# EAGLE design riffleito-REVC (EAGLE 6.5.0)
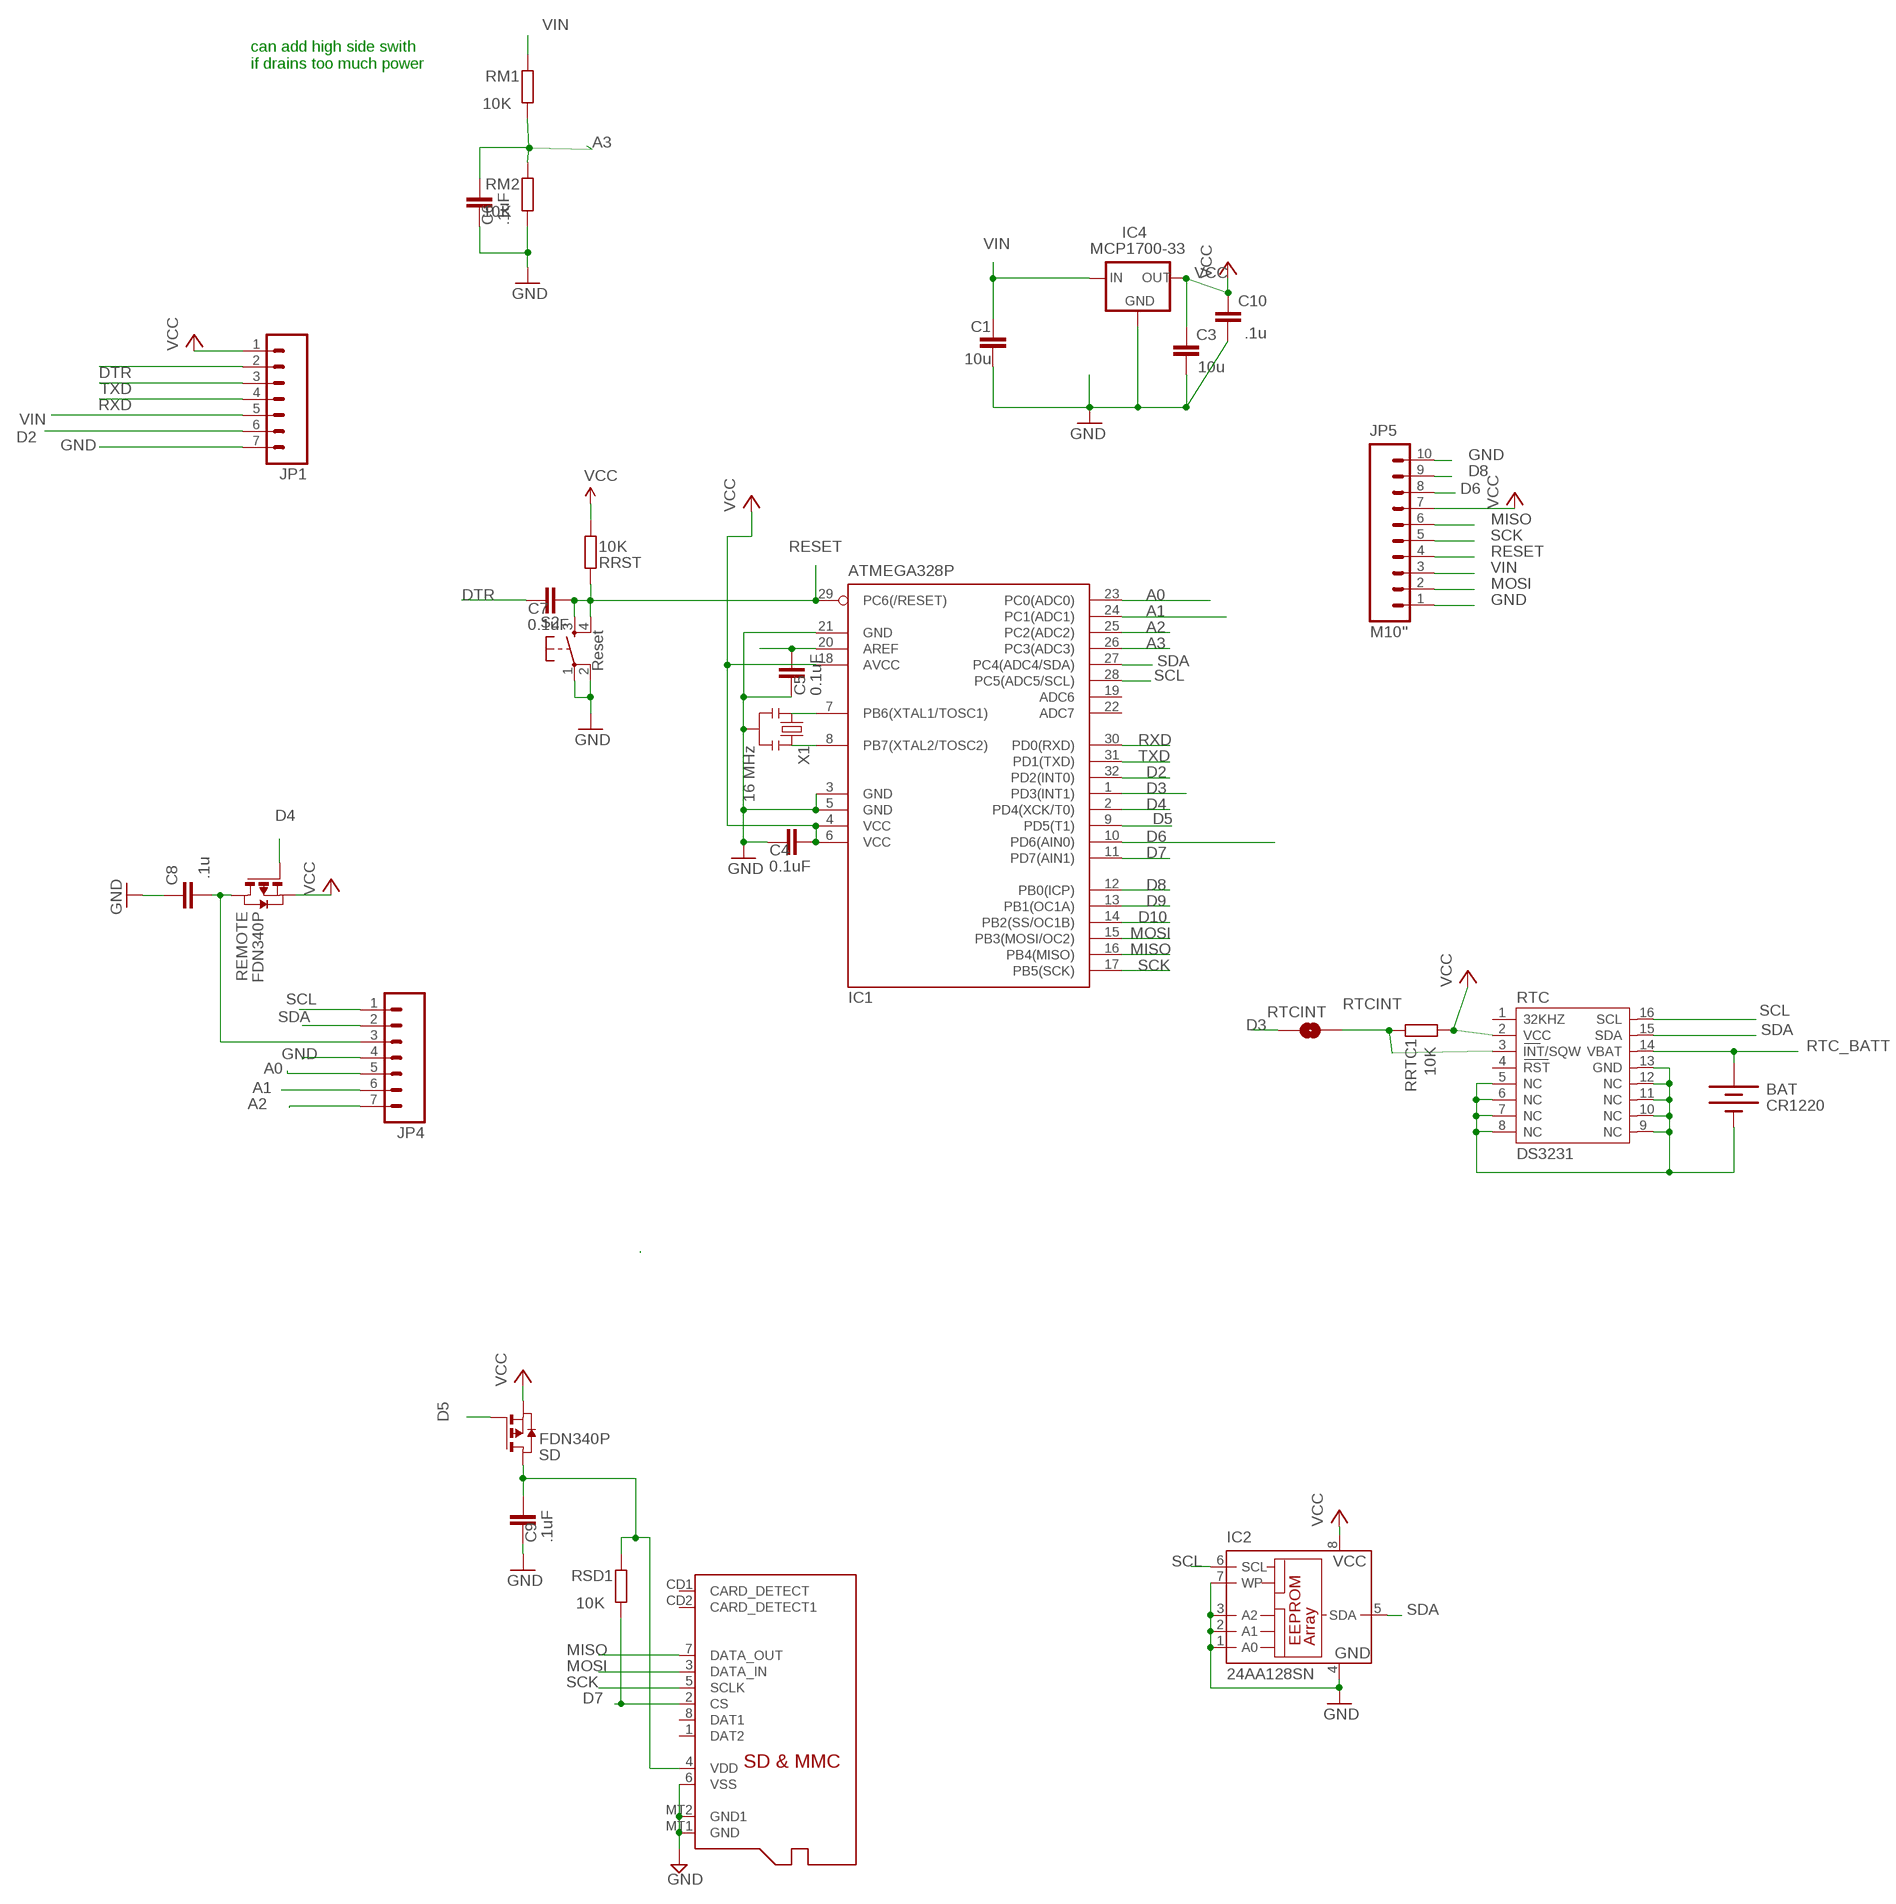
[diagram p0: schematic, sheet 1]

## Parts
BAT  CR1220  BATTERYBATTERY_12MM_SMT  [BATTCON_12MM_SMT]
C1  10u  C-EUC0805  [C0805]
C3  10u  C-EUC0805  [C0805]
C4  0.1uF  C-EUC0805  [C0805@1]
C5  0.1uF  C-EUC0805  [C0805@1]
C6  .1uF  C-EUC0805  [C0805@1]
C7  0.1uF  C-EUC0805  [C0805@1]
C8  .1u  C-EUC0805  [C0805]
C9  .1uF  C-EUC0805  [C0805@1]
C10  .1u  C-EUC0805  [C0805]
IC1  ATMEGA328P  MEGA8-AI  [TQFP32-08]
IC2  24AA128SN  [SO-08]
IC4  MCP1700-33  MCP1700SOT233  [SOT23]
JP1  M07  [1X07]
JP4  M07  [1X07]
JP5  M10"  [1X10]
MICROSD  MICROSD  [MICROSD]
REMOTE  FDN340P  PMOSSOT23  [SOT-23]
RM1  10K  R-EU_R0805  [R0805]
RM2  10K  R-EU_R0805  [R0805]
RRST  10K  R-EU_R0805  [R0805]
RRTC1  10K  R-EU_R0805  [R0805]
RSD1  10K  R-EU_R0805  [R0805]
RTC  DS3231  [DS3231]
RTCINT  SOLDERJUMPERNO  [SJ_2S-NO]
S2  Reset  TAC_SWITCHSMD  [TACTILE_SWITCH_SMD]
SD  FDN340P  PMOSSOT23  [SOT-23]
X1  16 MHz  RESONATORSMD  [RESONATOR-SMD]

## Nets
A0: IC1.23(PC0(ADC0)) JP4.5
A1: IC1.24(PC1(ADC1)) JP4.6
A2: IC1.25(PC2(ADC2)) JP4.7
A3: C6.2 IC1.26(PC3(ADC3)) RM1.1 RM2.2
AREF: C5.2 IC1.20(AREF)
D2: IC1.32(PD2(INT0)) JP1.6
D3: IC1.1(PD3(INT1)) RTCINT.2
D4: IC1.2(PD4(XCK/T0)) REMOTE.3(G)
D5: IC1.9(PD5(T1)) SD.3(G)
D6: IC1.10(PD6(AIN0)) JP5.8
D7: IC1.11(PD7(AIN1)) MICROSD.2(CS) RSD1.1
D8: IC1.12(PB0(ICP)) JP5.9
D9: IC1.13(PB1(OC1A))
D10: IC1.14(PB2(SS/OC1B))
DTR: C7.1 JP1.2
GND: BAT.P$1(-) C1.2 C3.2 C4.1 C5.1 C6.1 C8.1 C9.1 C10.2 IC1.3(GND) IC1.5(GND) IC1.21(GND) IC2.1(A0) IC2.2(A1) IC2.3(A2) IC2.4(GND) IC2.7(WP) IC4.1(GND) JP1.7 JP4.4 JP5.1 JP5.10 MICROSD.6(VSS) MICROSD.MT1(GND) MICROSD.MT2(GND1) RM2.1 RTC.5(NC) RTC.6(NC) RTC.7(NC) RTC.8(NC) RTC.9(NC) RTC.10(NC) RTC.11(NC) RTC.12(NC) RTC.13(GND) S2.1 S2.2 X1.2
MISO: IC1.16(PB4(MISO)) JP5.6 MICROSD.7(DATA_OUT)
MOSI: IC1.15(PB3(MOSI/OC2)) JP5.2 MICROSD.3(DATA_IN)
N$2: IC1.8(PB7(XTAL2/TOSC2)) X1.3
N$3: IC1.7(PB6(XTAL1/TOSC1)) X1.1
RESET: C7.2 IC1.29(PC6(/RESET)) JP5.4 RRST.2 S2.3 S2.4
RTC_BATT: BAT.P$2(+) RTC.14(VBAT)
RTCINT: RRTC1.2 RTC.3(INT/SQW) RTCINT.1
RXD: IC1.30(PD0(RXD)) JP1.4
SCK: IC1.17(PB5(SCK)) JP5.5 MICROSD.5(SCLK)
SCL: IC1.28(PC5(ADC5/SCL)) IC2.6(SCL) JP4.1 RTC.16(SCL)
SDA: IC1.27(PC4(ADC4/SDA)) IC2.5(SDA) JP4.2 RTC.15(SDA)
TXD: IC1.31(PD1(TXD)) JP1.3
VCC: C3.1 C4.2 C8.2 C10.1 IC1.4(VCC) IC1.6(VCC) IC1.18(AVCC) IC2.8(VCC) IC4.2(OUT) JP1.1 JP4.3 JP5.7 REMOTE.1(D) REMOTE.2(S) RRST.1 RRTC1.1 RTC.2(VCC) SD.2(S)
VDD: C9.2 MICROSD.4(VDD) RSD1.2 SD.1(D)
VIN [power]: C1.1 IC4.3(IN) JP1.5 JP5.3 RM1.2
Unconnected: IC1.19(ADC6) IC1.22(ADC7) MICROSD.1(DAT2) MICROSD.8(DAT1) MICROSD.CD1(CARD_DETECT) MICROSD.CD2(CARD_DETECT1) RTC.1(32KHZ) RTC.4(RST)

## Notes on the sheet
- can add high side swith
  if drains too much power

## Library data of the parts
BAT = SparkFunNew:BATTERY: Battery Holders Various common sizes : AA, AAA, 20mm coin cell and 12mm coin cell.
C1 C3 C8 C10 = resistor:C-EU: CAPACITOR, European symbol
C4-C7 C9 = rcl:C-EU: CAPACITOR, European symbol
IC1 = atmel:MEGA8: MICROCONTROLLER 8 Kbytes FLASH, 1 kbytes SRAM, 512 bytes EEPROM, USART, 6-channel 10 bit ADC, 2-channel 8 bit ADC Pin compatible with Atmega48, ATMega88, ATMega168 Source: avr.lbr; MPN: ATMEGA8-16AU; OC_FARNELL: 9171371; OC_NEWARK: 73M8863
IC2 = microchip:24*: Serial EEPROM I2C; MF: MICROCHIP; MPN: 24AA128-I/SN; OC_FARNELL: unknown; OC_NEWARK: 92C6842
IC4 = adafruit:MCP1700: VOLTAGE REGULATOR
JP1 JP4 = SparkFun-Connectors:M07: Header 7 Standard 7-pin 0.1" header. Use with straight break away headers (SKU : PRT-00116), right angle break away headers (PRT-00553), swiss pins (PRT-00743), machine pins (PRT-00117), and female headers (PRT-00115). NOTES ON THE VARIANTS LOCK and LOCK_LONGPADS... This footprint was designed to help hold the alignment of a through-hole component (i.e. 7-pin header) while soldering it into place. You may notice that each hole has been shifted either up or down by 0.005 of an inch from it's more standard position (which is usually a perfectly straight line). This slight alteration caused the pins (the squares in the middle) to touch the edges of the holes. Because they are alternating, it causes a "brace" to hold the header in place. 0.005 has proven to be the perfect amount of "off-center" position when using our standard breakaway headers. Although looks a little odd when you look at the bare footprint, once you have a header in there, the alteration is very hard to notice. Also, if you push a header all the way into place, it is covered up entirely on the bottom side. This idea of altering the position of holes to aid alignment will be further integrated into the Sparkfun Library for other footprints. It can help hold any component with 3 or more connection pins.
JP5 = SparkFun-Connectors:M10: Header 10 Standard 10-pin 0.1" header. Use with straight break away headers (SKU : PRT-00116), right angle break away headers (PRT-00553), swiss pins (PRT-00743), machine pins (PRT-00117), and female headers (PRT-00115).
MICROSD = adafruit:MICROSD: Micro-SD / Transflash card holder with SPI pinout For the 3M # 2908-05WB-MG and/or 4UCON #19656 push-push type
REMOTE SD = zetex:PMOSSOT23: MOS FET
RM1 RM2 RRST RRTC1 RSD1 = rcl:R-EU_: RESISTOR, European symbol
RTC = _lh-library:DS3231
RTCINT = _SparkFun:SOLDERJUMPER: Solder Jumper Standard SMD solder jumper. Used to automate production. Two varients : Normally Open and Normally Closed are the same, but have different paste layers. NC will have a large amount of paste and should jumper during reflow.
S2 = SparkFun:TAC_SWITCH: Momentary Switch Button commonly used for reset or general input. Spark Fun Electronics SKU : COM-00097
X1 = SparkFun:RESONATOR: Resonator Small SMD resonator. This is the itty bitty 10/20MHz resonators with built in caps. CSTCE10M0G55 and CSTCE20M0V53. Footprint has been reviewed closely but hasn't been tested yet.

## Net classes
0 default: width 0.203 mm, drill 0.33 mm, clearance 0.203 mm
1 power: width 0.381 mm, drill 0.33 mm, clearance 0.254 mm

## Board
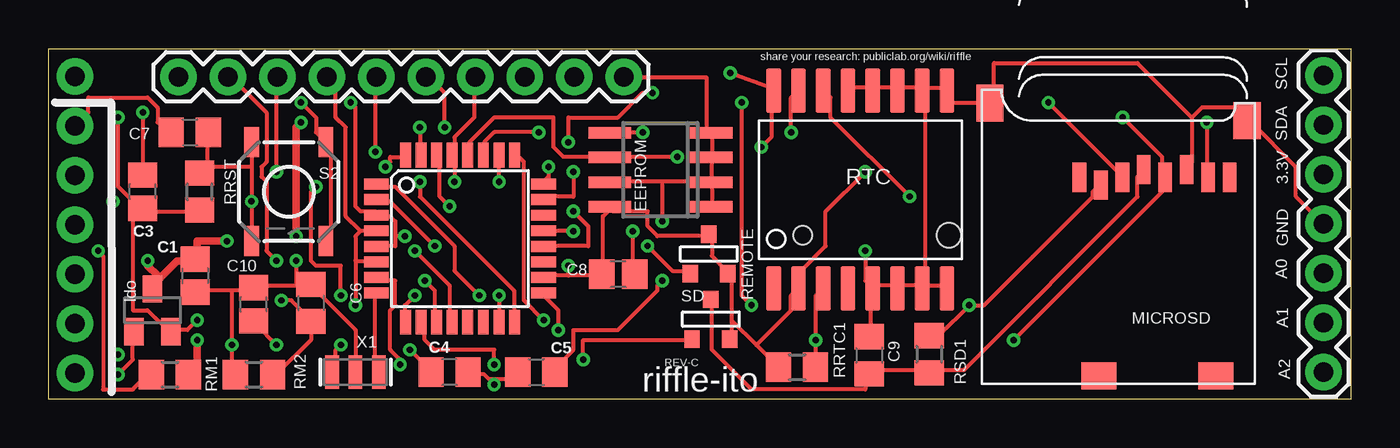
[diagram p1: board, top side]
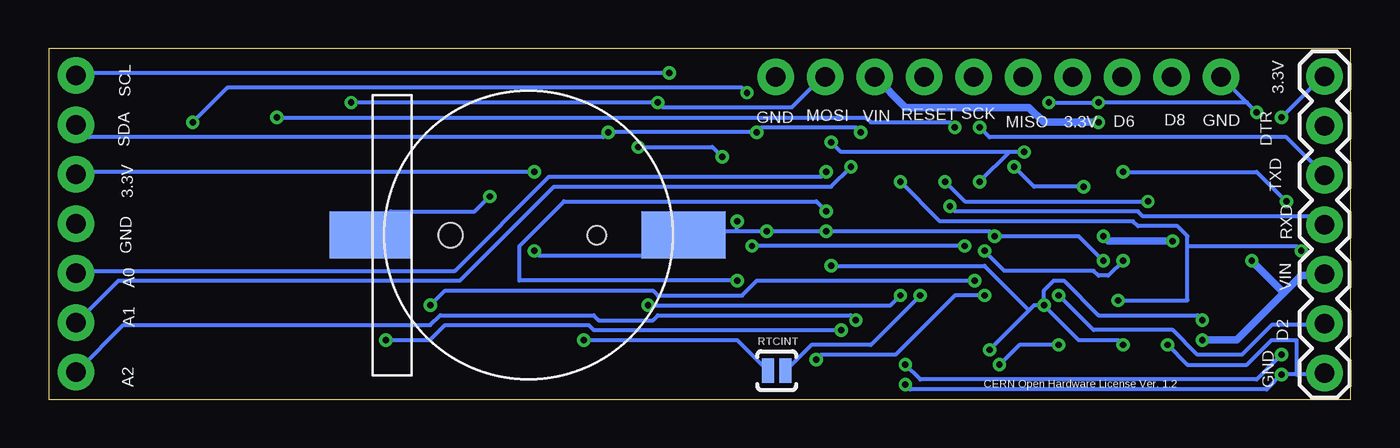
[diagram p2: board, bottom side, seen from below]

Size 66.83 x 18.01 mm. Coordinates in mm from the lower left corner, seen from the top.
Outline: 0,0 0,18.01 66.83,18.01 66.83,0 0,0
Copper layers (1*16): Top 0.0356mm / dielectric 1.5011mm / Bottom 0.0356mm
Design rules "LaenPCBOrder": minimum track width 6mil, minimum drill 13mil, track to track 6mil, track to pad 6mil, pad to pad 6mil, via to via 6mil, smd to smd 6mil, copper to edge 15mil, drill to drill 6mil, minimum pad ring 7mil, minimum via ring 7mil, stop-mask expansion 3mil, vias tented up to drill 0mil, thermal gap 10mil

### Footprints (pad centres in the part's own frame; a part is rotated, then mirrored left to right if it is on the bottom)
BATTCON_12MM_SMT = smd 2.4 x 4.3: P$1 0,11.96 | smd 2.4 x 4.2: P$2 0,-4.1 | hole 0.95: 0,7.5 | hole 1.25: 0,0
C0805 = smd 1.3 x 1.5: 1 -0.85,0; 2 0.85,0
C0805@1 = smd 1.3 x 1.5: 1 -0.95,0; 2 0.95,0
TQFP32-08 = smd 1.27 x 0.559: 1 -4.293,2.8; 2 -4.293,2; 3 -4.293,1.2; 4 -4.293,0.4; 5 -4.293,-0.4; 6 -4.293,-1.2; 7 -4.293,-2; 8 -4.293,-2.8; 17 4.293,-2.8; 18 4.293,-2; 19 4.293,-1.2; 20 4.293,-0.4; 21 4.293,0.4; 22 4.293,1.2; 23 4.293,2; 24 4.293,2.8 | smd 0.559 x 1.27: 9 -2.8,-4.293; 10 -2,-4.293; 11 -1.2,-4.293; 12 -0.4,-4.293; 13 0.4,-4.293; 14 1.2,-4.293; 15 2,-4.293; 16 2.8,-4.293; 25 2.8,4.293; 26 2,4.293; 27 1.2,4.293; 28 0.4,4.293; 29 -0.4,4.293; 30 -1.2,4.293; 31 -2,4.293; 32 -2.8,4.293
SO-08 = smd 0.6 x 2.2: 1 -1.905,-2.6; 2 -0.635,-2.6; 3 0.635,-2.6; 4 1.905,-2.6; 5 1.905,2.6; 6 0.635,2.6; 7 -0.635,2.6; 8 -1.905,2.6
SOT23 = smd 1 x 1.4: 1 -0.95,-1.1; 2 0.95,-1.1; 3 0,1.1
1X07 = drill 1.016 pad 1.88: 1 0,0; 2 2.54,0; 3 5.08,0; 4 7.62,0; 5 10.16,0; 6 12.7,0; 7 15.24,0
1X10 = drill 1.016 pad 1.88: 1 0,0; 2 2.54,0; 3 5.08,0; 4 7.62,0; 5 10.16,0; 6 12.7,0; 7 15.24,0; 8 17.78,0; 9 20.32,0; 10 22.86,0
MICROSD = smd 0.7 x 1.5: 1 9,-10.64; 2 7.9,-10.24; 3 6.8,-10.64; 4 5.7,-11.04; 5 4.6,-10.64; 6 3.5,-11.04; 7 2.4,-10.64; 8 1.3,-10.64 | smd 1.8 x 1.4: CD1 2,-0.44; CD2 8,-0.44 | smd 1.4 x 1.9: MT1 0.4,-13.54; MT2 13.6,-14.44
SOT-23 = smd 0.787 x 0.889: 1 0.025,-1.016; 2 -0.94,1.016; 3 0.991,1.016
R0805 = smd 1.3 x 1.5: 1 -0.95,0; 2 0.95,0
DS3231 = smd 0.762 x 2.286: 1 -4.445,-5.08; 2 -3.175,-5.08; 3 -1.905,-5.08; 4 -0.635,-5.08; 5 0.635,-5.08; 6 1.905,-5.08; 7 3.175,-5.08; 8 4.445,-5.08; 9 4.445,5.08; 10 3.175,5.08; 11 1.905,5.08; 12 0.635,5.08; 13 -0.635,5.08; 14 -1.905,5.08; 15 -3.175,5.08; 16 -4.445,5.08
SJ_2S-NO = smd 0.635 x 1.27: 1 -0.45,0; 2 0.45,0
TACTILE_SWITCH_SMD = smd 1.524 x 0.762: 1 -2.54,1.905; 2 2.54,1.905; 3 -2.54,-1.905; 4 2.54,-1.905
RESONATOR-SMD = smd 0.7 x 1.7: 1 -1.2,0; 2 0,0; 3 1.2,0

### Placement (x,y rotation side)
BAT  46.2,8.43 270 bottom
C1  7.52,6.35 270 top
C3  4.83,10.67 90 top
C4  20.57,1.4 180 top
C5  25.02,1.4 0 top
C6  13.46,4.95 270 top
C7  7.24,13.72 0 top
C8  29.24,6.43 180 top
C9  42.11,2.26 270 top
C10  10.52,4.88 90 top
IC1  21.11,8.26 0 top
IC2  31.39,11.79 90 top
IC4  5.33,4.57 0 top
JP1  1.35,16.59 270 bottom
JP4  65.43,16.64 270 top
JP5  29.51,16.56 180 top
MICROSD  61.9,0.76 180 top
REMOTE  33.91,7.47 180 top
RM1  6.22,1.27 0 top
RM2  10.54,1.27 0 top
RRST  7.75,10.67 90 top
RRTC1  38.4,1.65 0 top
RSD1  45.19,2.31 270 top
RTC  41.66,10.77 0 top
RTCINT  29.46,1.47 0 bottom
S2  12.32,10.67 270 top
SD  34.01,4.11 180 top
X1  15.75,1.4 0 top

### Tracks (layer width: path | path; a pad name or v marks a point on that pad's centre or on a via)
A0  (via drill 0.33)
  Top 0.203: v26.92,11.68 26.92,10.41 25.4,10.41 IC1.23
  Bottom 0.203: v26.92,11.68 27.18,11.43 41.15,11.43 45.97,6.6 65.28,6.6 JP4.5
A1  (via drill 0.33)
  Top 0.203: v25.65,11.94 25.65,11.43 25.4,11.18 IC1.24
  Bottom 0.203: v25.65,11.94 26.67,10.92 40.89,10.92 45.72,6.1 63.25,6.1 65.28,4.06 JP4.6
A2  (via drill 0.33)
  Top 0.203: v25.4,4.06 24.38,5.08 24.38,12.19 24.13,12.45 IC1.25
  Bottom 0.203: v25.4,4.06 25.65,4.32 35.56,4.32 35.81,4.06 38.61,4.06 38.86,4.32 46.74,4.32 47.24,3.81 62.99,3.81 65.28,1.52 JP4.7
A3  (via drill 0.33)
  Top 0.203: v23.11,11.18 23.11,12.45 IC1.26 | v11.94,5.08 12.45,5.08 13.46,4.06 C6.2 13.46,3.05 11.68,1.27 RM2.2 | v2.54,7.62 2.79,7.37 2.79,0.51 4.32,0.51 5.08,1.27 RM1.1
  Bottom 0.203: v23.11,11.18 21.08,9.14 11.18,9.14 10.92,8.89 8.89,8.89 8.38,8.38 8.38,7.87 | 8.38,7.87 8.38,5.08 v11.94,5.08 | v2.54,7.62 2.79,7.87 8.38,7.87
AREF  (via drill 0.33)
  Top 0.203: v26.92,9.65 27.69,8.89 27.69,7.87 25.4,7.87 IC1.20 | v31.5,6.1 31.24,5.84 31.24,5.59 29.21,3.56 26.92,3.56 26.92,2.54 26.16,1.78 26.16,1.52 C5.2
  Bottom 0.203: v26.92,9.65 27.43,10.16 40.39,10.16 42.67,7.87 42.67,6.1 v31.5,6.1
D2  (via drill 0.33)
  Top 0.203: v17.27,11.94 17.53,12.19 17.53,12.45 18.29,12.45 IC1.32 | v13.72,10.92 13.46,10.67 13.46,7.11 13.72,6.86 14.99,6.86 v14.99,5.33
  Bottom 0.203: v17.27,11.94 16.26,10.92 v13.72,10.92 | v14.99,5.33 13.21,3.56 9.14,3.56 7.87,2.29 5.59,2.29 4.06,3.81 1.52,3.81 JP1.6
D3  (via drill 0.33)
  Top 0.203: v22.1,5.33 20.83,6.6 20.83,7.87 17.78,10.92 17.02,10.92 IC1.1
  Bottom 0.203: v22.1,5.33 24.64,2.79 27.69,2.79 28.96,1.52 RTCINT.2
D4  (via drill 0.33)
  Top 0.203: v30.73,7.87 32,6.6 32.77,6.6 REMOTE.3 | v19.81,7.87 17.53,10.16 17.02,10.16 IC1.2
  Bottom 0.203: v19.81,7.87 v30.73,7.87
D5  (via drill 0.33)
  Top 0.203: v27.43,2.03 27.43,3.05 33.02,3.05 SD.3 | v18.8,5.33 18.29,4.83 18.29,4.06 IC1.9
  Bottom 0.203: v27.43,2.03 27.18,2.29 23.37,2.29 20.32,5.33 v18.8,5.33
D6  (via drill 0.33)
  Top 0.203: v22.86,1.78 22.86,2.54 19.81,2.54 19.3,3.05 19.3,3.81 IC1.10 | v3.56,2.29 3.3,2.54 v3.3,10.16 | v11.68,11.68 11.68,16.51 JP5.8
  Bottom 0.203: v22.86,1.78 22.1,1.02 4.83,1.02 v3.56,2.29 | v3.3,10.16 4.83,11.68 v11.68,11.68
D7  (via drill 0.33)
  Top 0.203: v19.3,6.1 19.81,5.59 19.81,4.06 IC1.11 | RSD1.1 45.21,3.3 45.72,3.3 v47.24,4.83 48.01,4.83 53.59,10.41 53.59,10.67 53.85,10.92 MICROSD.2
  Bottom 0.203: v19.3,6.1 30.48,6.1 31.24,5.33 35.56,5.33 35.81,5.59 46.48,5.59 v47.24,4.83
D8  (via drill 0.33)
  Top 0.203: v18.8,7.62 20.57,5.84 20.57,4.06 IC1.12 | v11.68,7.11 11.18,7.62 11.18,11.18 10.92,11.43 10.92,11.94 11.18,12.19 11.18,14.73 9.4,16.51 JP5.9
  Bottom 0.203: v18.8,7.62 17.78,6.6 13.21,6.6 12.95,6.35 12.45,6.35 v11.68,7.11
DTR
  Top 0.203: JP1.2 2.03,14.73 2.03,15.49 5.08,15.49 5.59,14.99 5.59,14.22 6.1,13.72 C7.1
GND  (via drill 0.33)
  Top 0.203: 58.67,14.48 58.67,12.19 58.42,11.94 MICROSD.6 | 58.67,14.48 59.18,14.99 61.47,14.99 61.47,14.48 MICROSD.MT1 61.72,14.22 64.01,11.94 64.01,10.41 65.28,9.14 JP4.4 | C9.1 42.16,3.3 42.16,5.59 RTC.5 | 44.96,5.84 45.97,5.84 RTC.8 | RTC.5 42.42,5.84 43.43,5.84 RTC.6 43.69,5.84 44.7,5.84 RTC.7 44.96,5.84 | RTC.13 41.15,16 42.16,16 RTC.12 42.42,16 43.43,16 RTC.11 43.69,16 44.7,16 RTC.10 | RTC.10 44.96,16 45.97,16 RTC.9 46.23,15.75 46.23,15.24 48.26,15.24 MICROSD.MT2 48.51,15.24 48.51,17.27 55.88,17.27 58.67,14.48 | 44.96,5.84 44.96,15.75 RTC.10 | 22.86,1.02 23.88,1.02 23.88,1.27 C5.1 | 22.86,1.02 22.61,1.02 22.35,1.27 21.59,1.27 C4.1 | v3.56,1.27 4.32,2.03 4.32,3.3 IC4.1 | v22.86,0.76 22.86,1.02 | S2.2 14.48,8.38 14.48,12.95 S2.1 13.72,13.72 13.72,14.48 v12.95,15.24 | v4.83,14.73 C3.2 | IC2.4 34.04,13.46 34.04,12.45 IC2.3 34.04,12.19 34.04,11.18 IC2.2 | 34.04,13.72 IC2.4 | 31.5,11.18 33.78,11.18 IC2.2 | 31.5,11.18 28.96,11.18 IC2.7 | IC2.1 34.04,9.91 34.04,10.92 IC2.2 | JP5.1 29.72,16.51 33.78,16.51 33.78,13.72 IC2.4 | 9.4,5.59 10.41,5.59 C10.2 10.67,5.84 12.7,5.84 | 9.4,5.59 7.62,5.59 C1.2 | 9.4,5.59 v9.4,2.79 9.4,1.27 RM2.1 | 12.7,5.84 13.46,5.84 | X1.2 15.75,3.56 13.46,5.84 | 13.46,5.84 C6.1 | 17.78,8.38 17.78,9.14 17.53,9.4 17.02,9.4 IC1.3 16.76,9.65 16,9.65 15.75,9.91 15.75,14.99 v15.49,15.24 | 17.78,8.38 17.78,7.87 17.02,7.87 IC1.5 | v26.92,8.64 25.4,8.64 IC1.21 | v29.97,8.64 29.97,6.6 C8.1 | v18.29,8.38 17.78,8.38 | v12.7,7.11 12.7,5.84 | v31.5,9.14 31.5,11.18 | v41.91,7.62 41.91,6.1 42.16,5.84 RTC.5
  Bottom 0.203: 2.79,1.27 1.52,1.27 JP1.7 | 2.79,1.27 v3.56,1.27 4.32,0.51 22.61,0.51 v22.86,0.76 | JP5.10 5.33,15.24 | 5.33,15.24 v4.83,14.73 | 5.33,15.24 v12.95,15.24 v15.49,15.24 | 31.5,8.64 34.04,8.64 BAT.P$1 34.29,8.38 35.31,7.37 41.66,7.37 v41.91,7.62 | 31.5,8.64 v29.97,8.64 v26.92,8.64 18.54,8.64 v18.29,8.38 13.97,8.38 v12.7,7.11 | 31.5,8.64 v31.5,9.14 | 2.79,1.27 2.79,3.05 4.06,3.05 5.33,1.78 8.38,1.78 v9.4,2.79
MISO  (via drill 0.33)
  Top 0.203: v19.05,11.18 19.05,10.41 23.88,5.59 23.88,4.06 IC1.16 | v16.76,12.7 16.76,16.51 JP5.6 | v59.44,14.22 59.44,11.43 MICROSD.7 | v30.99,15.75 30.48,15.75 29.21,14.48 26.67,14.48 v26.67,13.21
  Bottom 0.203: 17.53,12.7 v19.05,11.18 | v16.76,12.7 17.53,12.7 | v59.44,14.22 57.66,16 31.24,16 v30.99,15.75 | v26.67,13.21 26.16,12.7 17.53,12.7
MOSI  (via drill 0.33)
  Top 0.203: v23.11,5.33 23.11,4.06 IC1.15 | v36.07,4.83 35.56,5.33 v35.56,15.24 | v51.31,15.24 54.86,11.68 54.86,11.43 MICROSD.3
  Bottom 0.203: v23.11,5.33 23.62,4.83 v36.07,4.83 | JP5.2 27.18,16.51 28.7,14.99 35.31,14.99 v35.56,15.24 v51.31,15.24
N$2
  Top 0.203: IC1.8 16.76,5.33 16.76,1.52 X1.3
N$3  (via drill 0.33)
  Top 0.203: v18.03,1.78 18.03,2.03 17.53,2.54 17.53,4.57 17.78,4.83 17.78,6.1 17.02,6.1 IC1.7 | v14.99,2.79 14.73,2.54 14.73,1.52 X1.1
  Bottom 0.203: v18.03,1.78 17.02,2.79 v14.99,2.79
RESET  (via drill 0.33)
  Top 0.203: 8.13,11.94 7.87,11.68 RRST.2 8.13,11.94 | 8.13,11.94 8.13,13.72 C7.2 | S2.3 10.41,11.94 | 10.41,11.94 v10.41,10.16 S2.4 | 10.41,11.94 8.13,11.94 | JP5.4 21.84,16.51 21.84,14.48 20.83,13.46 20.83,12.7 IC1.29 20.83,12.45 v20.83,11.18
  Bottom 0.203: v10.41,10.16 19.81,10.16 v20.83,11.18
RTC_BATT  (via drill 0.33)
  Top 0.203: v44.2,10.41 40.13,14.48 40.13,15.49 39.88,15.75 RTC.14
  Bottom 0.203: v44.2,10.41 44.96,9.65 49.28,9.65 50.29,8.64 BAT.P$2
RTCINT  (via drill 0.33)
  Top 0.203: RRTC1.2 39.37,1.78 v39.37,3.05 39.37,5.33 39.62,5.59 RTC.3
  Bottom 0.203: v39.37,3.05 31.5,3.05 29.97,1.52 RTCINT.1
RXD  (via drill 0.33)
  Top 0.203: v20.57,9.91 20.07,10.41 20.07,12.45 IC1.30
  Bottom 0.203: v20.57,9.91 20.32,9.65 10.92,9.65 10.67,9.4 1.78,9.4 JP1.4
SCK  (via drill 0.33)
  Top 0.203: v26.16,3.56 26.16,4.57 25.4,5.33 IC1.17 | v49.53,3.05 57.15,10.67 57.15,11.18 MICROSD.5 57.15,11.43 57.15,12.45 v55.12,14.48 | v20.32,13.97 20.32,15.75 19.56,16.51 JP5.5
  Bottom 0.203: v26.16,3.56 38.86,3.56 39.12,3.81 46.48,3.81 47.24,3.05 v49.53,3.05 | v20.32,13.97 20.57,14.22 24.64,14.22 24.89,14.48 v55.12,14.48
SCL  (via drill 0.33)
  Top 0.203: IC1.28 21.59,12.7 21.59,13.21 22.86,14.48 25.91,14.48 25.91,12.95 26.42,12.45 28.7,12.45 IC2.6 28.96,12.45 v32.26,12.45 | v34.98,16.76 37.08,16 RTC.16 37.08,15.75 37.08,13.46 v36.58,12.95
  Bottom 0.203: v34.98,16.76 65.28,16.76 JP4.1 | v32.26,12.45 32.77,12.95 v36.58,12.95
SDA  (via drill 0.33)
  Top 0.203: v25.15,13.72 22.86,13.72 22.35,13.21 22.35,12.7 IC1.27 | v30.48,13.72 28.96,13.72 IC2.5 | v38.1,13.72 38.1,15.49 38.35,15.75 RTC.15
  Bottom 0.203: v25.15,13.72 25.4,13.97 30.23,13.97 v30.48,13.72 v38.1,13.72 38.35,13.46 64.77,13.46 65.28,13.97 JP4.2
TXD  (via drill 0.33)
  Top 0.203: v19.05,13.97 19.05,12.7 IC1.31
  Bottom 0.203: v19.05,13.97 18.54,13.46 3.3,13.46 JP1.3
VCC  (via drill 0.33)
  Top 0.203: 4.83,9.65 4.32,9.14 4.32,4.57 5.08,4.57 6.1,3.56 IC4.2 6.35,3.56 7.11,3.56 v7.62,4.06 | 4.83,9.65 7.62,9.65 RRST.1 | v3.56,14.48 3.56,10.92 4.83,9.65 | 4.83,9.65 C3.1 | 15.75,7.11 16.76,7.11 IC1.6 | 15.75,7.11 15.75,8.38 16,8.64 | 16,8.64 16.76,8.64 IC1.4 | v18.54,2.54 19.56,1.52 C4.2 | 15.75,7.11 v15.75,4.83 | v11.68,2.79 10.67,3.81 C10.1 | 16,8.64 15.24,9.4 15.24,13.97 14.73,14.48 14.73,16.26 14.48,16.51 JP5.7 | 28.96,9.91 IC2.8 | 26.67,6.35 28.19,6.35 C8.2 28.45,6.6 28.45,9.4 28.7,9.65 IC2.8 | 26.67,6.35 25.4,6.35 IC1.18 | 35.05,4.06 35.05,6.35 REMOTE.2 34.8,6.6 34.04,7.37 34.04,8.38 REMOTE.1 33.78,8.38 31.24,8.38 30.73,8.89 30.73,9.65 28.96,9.65 IC2.8 | 35.05,4.06 35.05,3.3 SD.2 | 35.05,4.06 36.32,2.79 | 36.32,2.79 37.34,1.78 RRTC1.1 | 36.32,2.79 38.1,4.57 38.1,5.33 38.35,5.59 RTC.2 38.61,5.84 38.61,6.6 39.88,7.87 39.88,9.65 v41.91,11.68 | 26.67,6.35 v26.67,6.86
  Bottom 0.203: v3.56,14.48 1.52,16.51 JP1.1 | 16.51,4.57 16.26,4.83 v15.75,4.83 | 16.51,4.57 v18.54,2.54 | v11.68,2.79 11.94,3.05 13.97,3.05 v15.75,4.83 | v7.62,4.06 7.87,4.32 12.95,4.32 14.73,6.1 15.24,6.1 15.75,5.59 v15.75,4.83 | v41.91,11.68 65.28,11.68 JP4.3 | 16.51,4.57 18.8,6.86 v26.67,6.86
VDD
  Top 0.203: SD.1 34.04,5.08 34.04,2.54 36.07,0.51 41.91,0.51 41.91,1.27 C9.2 42.16,1.52 44.96,1.52 RSD1.2 45.21,1.52 46.99,1.52 55.88,10.41 55.88,11.43 56.13,11.68 MICROSD.4
VIN  (via drill 0.33)
  Top 0.381: v7.62,3.05 7.62,1.52 7.37,1.27 RM1.2 | v5.08,7.11 5.08,6.86 5.59,6.35 IC4.3 5.33,5.84 6.6,7.11 7.37,7.11 C1.1 7.62,7.37 7.62,8.13 v9.14,8.13 | v12.95,14.22 12.7,13.97 v12.7,8.38
  Bottom 0.381: v7.62,3.05 5.84,3.05 3.43,5.46 | 3.43,5.46 2.54,6.35 1.52,6.35 JP1.5 | 3.43,5.46 v5.08,7.11 | JP5.3 22.86,14.99 16.51,14.99 15.75,14.22 v12.95,14.22 | v12.7,8.38 12.45,8.13 v9.14,8.13

### Text on the board
tPlace: share your research: publiclab.org/wiki/riffle | SCL | SDA | EEPROM | 3.3V | GND | A0 | ldo | A1 | REV-C | riffle-ito | A2
bPlace: SCL | 3.3V | GND | D8 | D6 | 3.3V | MISO | RESET | VIN | GND | SDA | SCK | MOSI | DTR | 3.3V | TXD | GND | RXD | A0 | VIN | A1 | D2 | A2 | GND | CERN Open Hardware License Ver. 1.2